# Altium schematic sheet MCU3.SchDoc
size A3; SheetNumber: 4; SheetTotal: 8
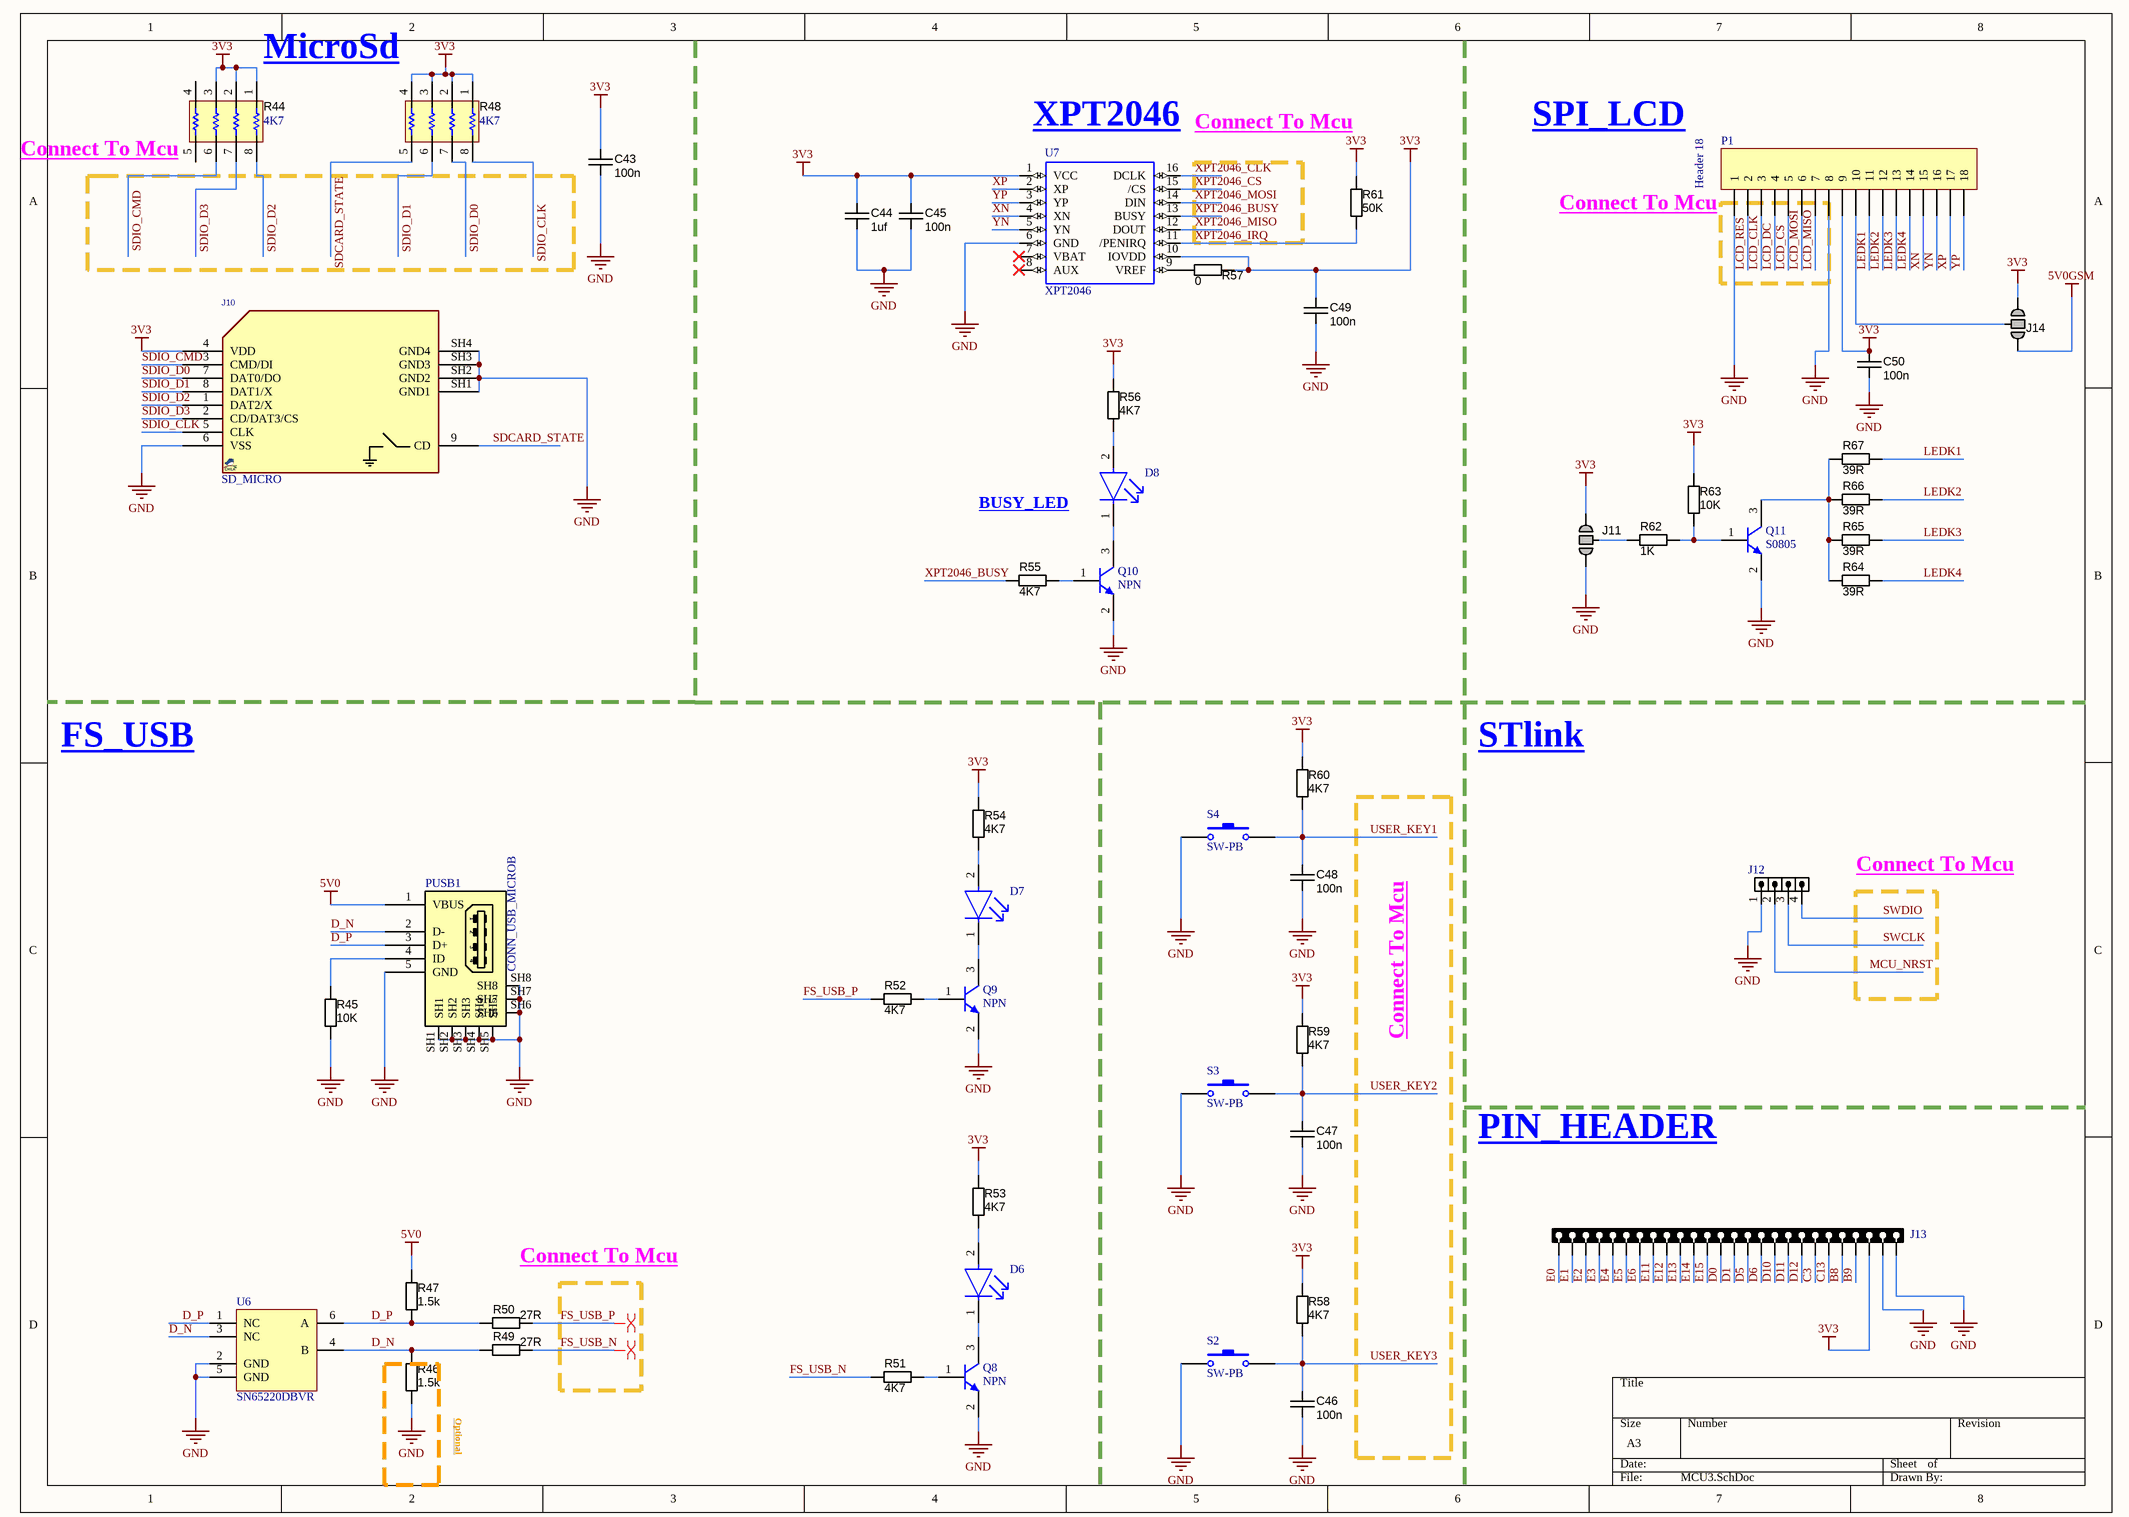
[diagram p0: MCU3.SchDoc]

## Parts
C43  value 100n  [CAPC1608X90N]  (hidden comment: approved sub OK)
C44  1uf  [CAPC3216X180N]
C45  value 100n  [CAPC1608X90N]  (hidden comment: approved sub OK)
C46  value 100n  [CAPC1608X90N]  (hidden comment: approved sub OK)
C47  value 100n  [CAPC1608X90N]  (hidden comment: approved sub OK)
C48  value 100n  [CAPC1608X90N]  (hidden comment: approved sub OK)
C49  value 100n  [CAPC1608X90N]  (hidden comment: approved sub OK)
C50  value 100n  [CAPC1608X90N]  (hidden comment: approved sub OK)
D6  LTST-C191TBKT  [FP-LTST-C191TBKT-MFG]  (value not drawn)
D7  LTST-C191TBKT  [FP-LTST-C191TBKT-MFG]  (value not drawn)
D8  LTST-C191TBKT  [FP-LTST-C191TBKT-MFG]  (value not drawn)
J10  SD_MICRO  [SDMICRO_AT]
J11  Jumper  [Jump_3Way]  (value not drawn)  (no BOM)
J12  HDR1X4  [HDR1X4_2.54mmp]  (value not drawn)
J13  HDRF26  [HDR 1X26]  (value not drawn)
J14  Jumper  [Jump_3Way]  (value not drawn)  (no BOM)
P1  Header 18  [SPI_LCD_18Pin]
PUSB1  CONN_USB_MICROB  [USB_MICRO_B_BM_SHS]
Q8  NPN  [SOT23-3]
Q9  NPN  [SOT23-3]
Q10  NPN  [SOT23-3]
Q11  S0805  [SOT23-3]
R44  value 4K7  [RP0603X4]  (hidden comment: Resistor Array SMD)
R45  value 10K  [RESC1608X55N]  (hidden comment: Thick Film)
R46  value 1.5k  [RESC1608X55N]  (hidden comment: Thick Film)
R47  value 1.5k  [RESC1608X55N]  (hidden comment: Thick Film)
R48  value 4K7  [RP0603X4]  (hidden comment: Resistor Array SMD)
R49  value 27R  [RESC1608X55N]  (hidden comment: Thick Film)
R50  value 27R  [RESC1608X55N]  (hidden comment: Thick Film)
R51  value 4K7  [RESC1608X55N]  (hidden comment: Thick Film)
R52  value 4K7  [RESC1608X55N]  (hidden comment: Thick Film)
R53  value 4K7  [RESC1608X55N]  (hidden comment: Thick Film)
R54  value 4K7  [RESC1608X55N]  (hidden comment: Thick Film)
R55  value 4K7  [RESC1608X55N]  (hidden comment: Thick Film)
R56  value 4K7  [RESC1608X55N]  (hidden comment: Thick Film)
R57  value 0  [RESC1608X55N]  (hidden comment: Thick Film)
R58  value 4K7  [RESC1608X55N]  (hidden comment: Thick Film)
R59  value 4K7  [RESC1608X55N]  (hidden comment: Thick Film)
R60  value 4K7  [RESC1608X55N]  (hidden comment: Thick Film)
R61  value 50K  [RESC1608X55N]  (hidden comment: Thick Film)
R62  value 1K  [RESC1608X55N]  (hidden comment: Thick Film)
R63  value 10K  [RESC1608X55N]  (hidden comment: Thick Film)
R64  value 39R  [RESC1608X55N]  (hidden comment: Thick Film)
R65  value 39R  [RESC1608X55N]  (hidden comment: Thick Film)
R66  value 39R  [RESC1608X55N]  (hidden comment: Thick Film)
R67  value 39R  [RESC1608X55N]  (hidden comment: Thick Film)
S2  SW-PB  [SWPBS_SPST_6X3X5]
S3  SW-PB  [SWPBS_SPST_6X3X5]
S4  SW-PB  [SWPBS_SPST_6X3X5]
U6  SN65220DBVR  [DBV0006A_M]
U7  XPT2046  [TSSOP16]

## Nets
3V3: C43.1 C44.1 C45.1 C49.1 C50.1 J10.4(VDD) J11.3 J13.24 J14.1 P1.9 R44.1 R44.2 R44.3 R48.1 R48.2 R48.3 R48.4 R53.2 R54.2 R56.2 R57.1 R58.1 R59.1 R60.1 R61.1 R63.2 U7.1(VCC) U7.10(IOVDD)
5V0: PUSB1.1(VBUS) R47.1
5V0GSM: J14.3
GND: C43.2 C44.2 C45.2 C46.2 C47.2 C48.2 C49.2 C50.2 J10.6(VSS) J10.SH1(GND1) J10.SH2(GND2) J10.SH3(GND3) J10.SH4(GND4) J11.1 J12.1 J13.25 J13.26 P1.1 P1.8 PUSB1.5(GND) PUSB1.SH1 PUSB1.SH2 PUSB1.SH3 PUSB1.SH4 PUSB1.SH5 PUSB1.SH6 PUSB1.SH7 PUSB1.SH8 Q8.2(E) Q9.2(E) Q10.2(E) Q11.2(E) R45.1 R46.2 S2.2 S3.2 S4.2 U6.2(GND) U6.5(GND) U7.6(GND)
B8: J13.22
B9: J13.23
C3: J13.20
C13: J13.21
D0: J13.13
D1: J13.14
D5: J13.15
D6: J13.16
D10: J13.17
D11: J13.18
D12: J13.19
D_N: PUSB1.2(D-) R46.1 R49.1 U6.3(NC) U6.4(B)
D_P: PUSB1.3(D+) R47.2 R50.1 U6.1(NC) U6.6(A)
E0: J13.1
E1: J13.2
E2: J13.3
E3: J13.4
E4: J13.5
E5: J13.6
E6: J13.7
E11: J13.8
E12: J13.9
E13: J13.10
E14: J13.11
E15: J13.12
FS_USB_N: R49.2 R51.1
FS_USB_P: R50.2 R52.1
LCD_CLK: P1.3
LCD_CS: P1.5
LCD_DC: P1.4
LCD_MISO: P1.7
LCD_MOSI: P1.6
LCD_RES: P1.2
LEDK1: P1.11 R67.2
LEDK2: P1.12 R66.2
LEDK3: P1.13 R65.2
LEDK4: P1.14 R64.2
MCU_NRST: J12.2
SDCARD_STATE: J10.9(CD) R48.5
SDIO_CLK: J10.5(CLK) R48.8
SDIO_CMD: J10.3(CMD/DI) R44.6
SDIO_D0: J10.7(DAT0/DO) R48.7
SDIO_D1: J10.8(DAT1/X) R48.6
SDIO_D2: J10.1(DAT2/X) R44.8
SDIO_D3: J10.2(CD/DAT3/CS) R44.7
SWCLK: J12.3
SWDIO: J12.4
USER_KEY1: C48.1 R60.2 S4.1
USER_KEY2: C47.1 R59.2 S3.1
USER_KEY3: C46.1 R58.2 S2.1
XN: P1.15 U7.4(XN)
XP: P1.17 U7.2(XP)
XPT2046_BUSY: R55.1 U7.13(BUSY)
XPT2046_CLK: U7.16(DCLK)
XPT2046_CS: U7.15(/CS)
XPT2046_IRQ: R61.2 U7.11(/PENIRQ)
XPT2046_MISO: U7.12(DOUT)
XPT2046_MOSI: U7.14(DIN)
YN: P1.16 U7.5(YN)
YP: P1.18 U7.3(YP)
NetD6_1: D6.1(C) Q8.3(C)
NetD6_2: D6.2(A) R53.1
NetD7_1: D7.1(C) Q9.3(C)
NetD7_2: D7.2(A) R54.1
NetD8_1: D8.1(C) Q10.3(C)
NetD8_2: D8.2(A) R56.1
NetJ11_2: J11.2 R62.2
NetJ14_2: J14.2 P1.10
NetPUSB1_4: PUSB1.4(ID) R45.2
NetQ8_1: Q8.1(B) R51.2
NetQ9_1: Q9.1(B) R52.2
NetQ10_1: Q10.1(B) R55.2
NetQ11_1: Q11.1(B) R62.1 R63.1
NetQ11_3: Q11.3(C) R64.1 R65.1 R66.1 R67.1
NetR57_2: R57.2 U7.9(VREF)

Not connected (* = marked no-connect by the designer): R44 4 5; U7 7(VBAT)* 8(AUX)*

## Layout directives
differential pair: FS_USB_N, FS_USB_P

## Notes on the sheet
- MicroSd
- (near R44) Connect To Mcu
- (near U7) XPT2046
- Connect To Mcu
- SPI_LCD
- (near P1) Connect To Mcu
- BUSY_LED
- FS_USB
- STlink
- PIN_HEADER
- Optional

## Library data of the parts
C43 C45-C50 = CAPC_100n_0603_X7R_50V_10%: Capacitor SMD Cer 100nF 10% 50V X7R 0603; Manufacturer 1: AVX Corporation; Manufacturer Part Number 1: 06035C104KAT2A; Ratings: 50V; X7R; Material: ceramic; SCDType: spec; Manufacturer 2: TDK Corporation; Manufacturer Part Number 2: C1608X7R1H104K; Package / Case: 0603 (1608 Metric); Tolerance: ±10%; Supplier 1: Digi-Key; Supplier Part Number 1: 478-5052-1-ND; ComponentLink1URL: http://www.avx.com/docs/Catalogs/cx7r.pdf; ComponentLink1Description: http://www.avx.com/docs/Catalogs/cx7r.pdf; Supplier 2: Digi-Key; Supplier Part Number 2: 445-1314-1-ND; ComponentLink2URL: http://product.tdk.com/capacitor/mlcc/en/documents/mlcc_commercial_general_en.pdf; ComponentLink2Description: http://product.tdk.com/capacitor/mlcc/en/documents/mlcc_commercial_general_en.pdf
C44 = CAPC_47n_1206_X7R_50V_10%: Capacitor SMD Cer 47nF 10% 50V X7R 1206; Manufacturer 1: Yageo; Manufacturer Part Number 1: CC1206KRX7R9BB473; Ratings: 50V; X7R; SCDType: spec; Package / Case: 1206 (3216 Metric); Tolerance: ±10%; Operating Temperature: -55°C ~ 125°C; Size / Dimension: 0.126" L x 0.063" W (3.20mm x 1.60mm); Supplier 1: Digi-Key; Voltage - Rated: 50V; Supplier Part Number 1: 311-1178-1-ND; Value: 1uf
D6-D8 = CMP-22017-000008-1: LED BLUE CLEAR CHIP SMD; Lens Color: Colorless; Dominant Wavelength: 475nm; Forward Current: 20mA; Wavelength: 468nm; Viewing Angle: 130°; Power Dissipation: 76mW; Luminous Intensity: 180mcd; Reverse Voltage: 5V; Number of Elements: 1; Lens Style: Diffused; Forward Voltage: 3.8V; Max Power Dissipation: 75mW; Case Code (Metric): 1608; Packaging: Tape and Reel; Case/Package: 0603; Depth: 1.6mm; Mount: Surface Mount; Lead Free: Lead Free; Min Operating Temperature: -20°C; Lens Transparency: Clear; Illumination Color: Blue; Height: 0.55mm; Test Current: 20mA; Case Code (Imperial): 0603; Max Operating Temperature: 80°C; Number of Pins: 2; Length: 0.8mm; Radiation Hardening: No; Package Quantity: 1; Number of LEDs: 1; Width: 0.8mm; Color: Blue
J10 = SOCKET_SDMICRO_AT: SD MICRO exist in Iran, Attend 112J-TDAR-R01; PARAM: push-push; MANF: Attend; MANF_P#: 112J-TDAR-R01; VALUE: SD_MICRO
J11 J14 = JUMP_3WAY: SMD jumper
J12 = HDR_M_1X4: CONN, HEADER, Male, pitch: 2.54mm, 4POS; VALUE: HDRM4
J13 = HDR_F_1X26: CONN, HEADER, Male, pitch: 2.54mm, 26POS; Website Smart World: https://www.smartw.ir/; VALUE: HDRF26
P1 = Header 18: Header, 18-Pin; LatestRevisionDate: 17-Jul-2002; LatestRevisionNote: Re-released for DXP Platform.; Publisher: Altium Limited
PUSB1 = CONN_USB_MICRO_B_MOLEX: CONN, USB, MICRO B, R/A, SMD, BOTTOM MOUNT; MANF_P#: 47491-0001; MANF: MOLEX; VALUE: CONN_USB_MICROB
Q8-Q11 = NPN: NPN Bipolar Transistor; Published: 8-Jun-2000; LatestRevisionDate: 17-Jul-2002; LatestRevisionNote: Re-released for DXP Platform.; PackageReference: TO-226-AA; Publisher: Altium Limited; PackageDescription: TO, Flat Index; 3 In-Line, Axial Leads; Body Dia. 4.8mm; Leads 0.55 x 0.51 mm (max); Code_JEDEC: TO-226-AA
R45 R61 R63 = RES_4K7_0603_5%: Resistor SMD chip 10K Ohm 0.1W 5% 0603; Manufacturer 1: Vishay/Dale; Manufacturer Part Number 1: CRCW06034K70JNEA; Ratings: 1/10 W; SCDType: spec; Package / Case: 0603 (1608 metric); Tolerance: ±5%; Material: Thick Film; Supplier 1: Digi-Key; Supplier Part Number 1: 541-4.7KGCT-ND
R46 R47 = RES_4K7_0603_5%: Resistor SMD chip 1.5k Ohm 0.1W 5% 0603; Manufacturer 1: Vishay/Dale; Manufacturer Part Number 1: CRCW06034K70JNEA; Ratings: 1/10 W; SCDType: spec; Package / Case: 0603 (1608 metric); Tolerance: ±5%; Material: Thick Film; Supplier 1: Digi-Key; Supplier Part Number 1: 541-4.7KGCT-ND
R49 R50 = RES_4K7_0603_5%: Resistor SMD chip 27 Ohm 0.1W 5% 0603; Manufacturer 1: Vishay/Dale; Manufacturer Part Number 1: CRCW06034K70JNEA; Ratings: 1/10 W; SCDType: spec; Package / Case: 0603 (1608 metric); Tolerance: ±5%; Material: Thick Film; Supplier 1: Digi-Key; Supplier Part Number 1: 541-4.7KGCT-ND
R51-R56 R58-R60 = RES_4K7_0603_5%: Resistor SMD chip 4.7k Ohm 0.1W 5% 0603; Manufacturer 1: Vishay/Dale; Manufacturer Part Number 1: CRCW06034K70JNEA; Ratings: 1/10 W; SCDType: spec; Package / Case: 0603 (1608 metric); Tolerance: ±5%; Material: Thick Film; Supplier 1: Digi-Key; Supplier Part Number 1: 541-4.7KGCT-ND
R57 = RES_4K7_0603_5%: Resistor SMD chip 0 Ohm 0.1W 5% 0603; Manufacturer 1: Vishay/Dale; Manufacturer Part Number 1: CRCW06034K70JNEA; Ratings: 1/10 W; SCDType: spec; Package / Case: 0603 (1608 metric); Tolerance: ±5%; Material: Thick Film; Supplier 1: Digi-Key; Supplier Part Number 1: 541-4.7KGCT-ND
R62 = RES_4K7_0603_5%: Resistor SMD chip 1K Ohm 0.1W 5% 0603; Manufacturer 1: Vishay/Dale; Manufacturer Part Number 1: CRCW06034K70JNEA; Ratings: 1/10 W; SCDType: spec; Package / Case: 0603 (1608 metric); Tolerance: ±5%; Material: Thick Film; Supplier 1: Digi-Key; Supplier Part Number 1: 541-4.7KGCT-ND
R64-R67 = RES_4K7_0603_5%: Resistor SMD chip 39R Ohm 0.1W 5% 0603; Manufacturer 1: Vishay/Dale; Manufacturer Part Number 1: CRCW06034K70JNEA; Ratings: 1/10 W; SCDType: spec; Package / Case: 0603 (1608 metric); Tolerance: ±5%; Material: Thick Film; Supplier 1: Digi-Key; Supplier Part Number 1: 541-4.7KGCT-ND
S2-S4 = SW-PB: Switch; Published: 24-Mar-1999; LatestRevisionDate: 17-Jul-2002; LatestRevisionNote: Re-released for DXP Platform.; PackageReference: SPST-2; Publisher: Altium Limited; PackageDescription: Switch; 2 Leads
U6 = CMP-0326-00064-3: Single Universal Serial Bus Port Transient Suppressor, 2 Channels, -40 to +85 degC, 6-pin SOT-23 (DBV), Green (RoHS & no Sb/Br); Manufacturer: Texas Instruments; IO Leakage Current(nA): 1000; Breakdown Voltage(Min)(V): 7; SubFamily: ESD Solution; USB Full Speed: TRUE; IO Capacitance(Typ)(pF): 35; ComponentLink1URL: http://www.ti.com/; PackageVersion: revK, Mar-2006; Mounting Technology: Surface Mount; ComponentLink2URL: http://www.ti.com/general/docs/lit/getliterature.tsp?genericPartNumber=SN65220&fileType=pdf; PackageDescription: 6-Pin Plastic Small-Outline Package, 2.9 x 1.6 mm Body, 0.95 mm Pitch, 2.8 mm Lead Span; PackageReference: DBV0006A; Eco-Plan: Green (RoHS & no Sb/Br); ComponentLink3Description: URL Link1; ComponentLink2Description: Datasheet; ComponentLink1Description: Manufacturer URL; DatasheetVersion: SLLS266G; PartNumber: SN65220DBVR; ComponentLink3URL: SamplesURL:http://www.ti.com/product/sn65220#samples
U7 = XPT2046: RASPBERRY PI 3.5 TFT DISPLAY; MF: Xptek; Value: *; Package: Package; Availability: Unavailable; SnapEDA_Link: https://www.snapeda.com/parts/XPT2046/Xptek/view-part/5164510/?ref=snap; MP: XPT2046; Price: None; Check_prices: https://www.snapeda.com/parts/XPT2046/Xptek/view-part/5164510/?ref=eda
R44 R48 = Resistor Array SMD: DatasheetVersion: 2021; ComponentLink1Description: Website Smart World; ComponentLink1URL: https://www.smartw.ir/; ComponentLink2Description: Telegram; ComponentLink2URL: https://t.me/altium_smartw; ComponentLink3Description: Instagram; ComponentLink3URL: https://Instagram.com/smartgw.ir